# Altium schematic sheet Sheet1.SchDoc
size A4; SheetNumber: 1; SheetTotal: 1
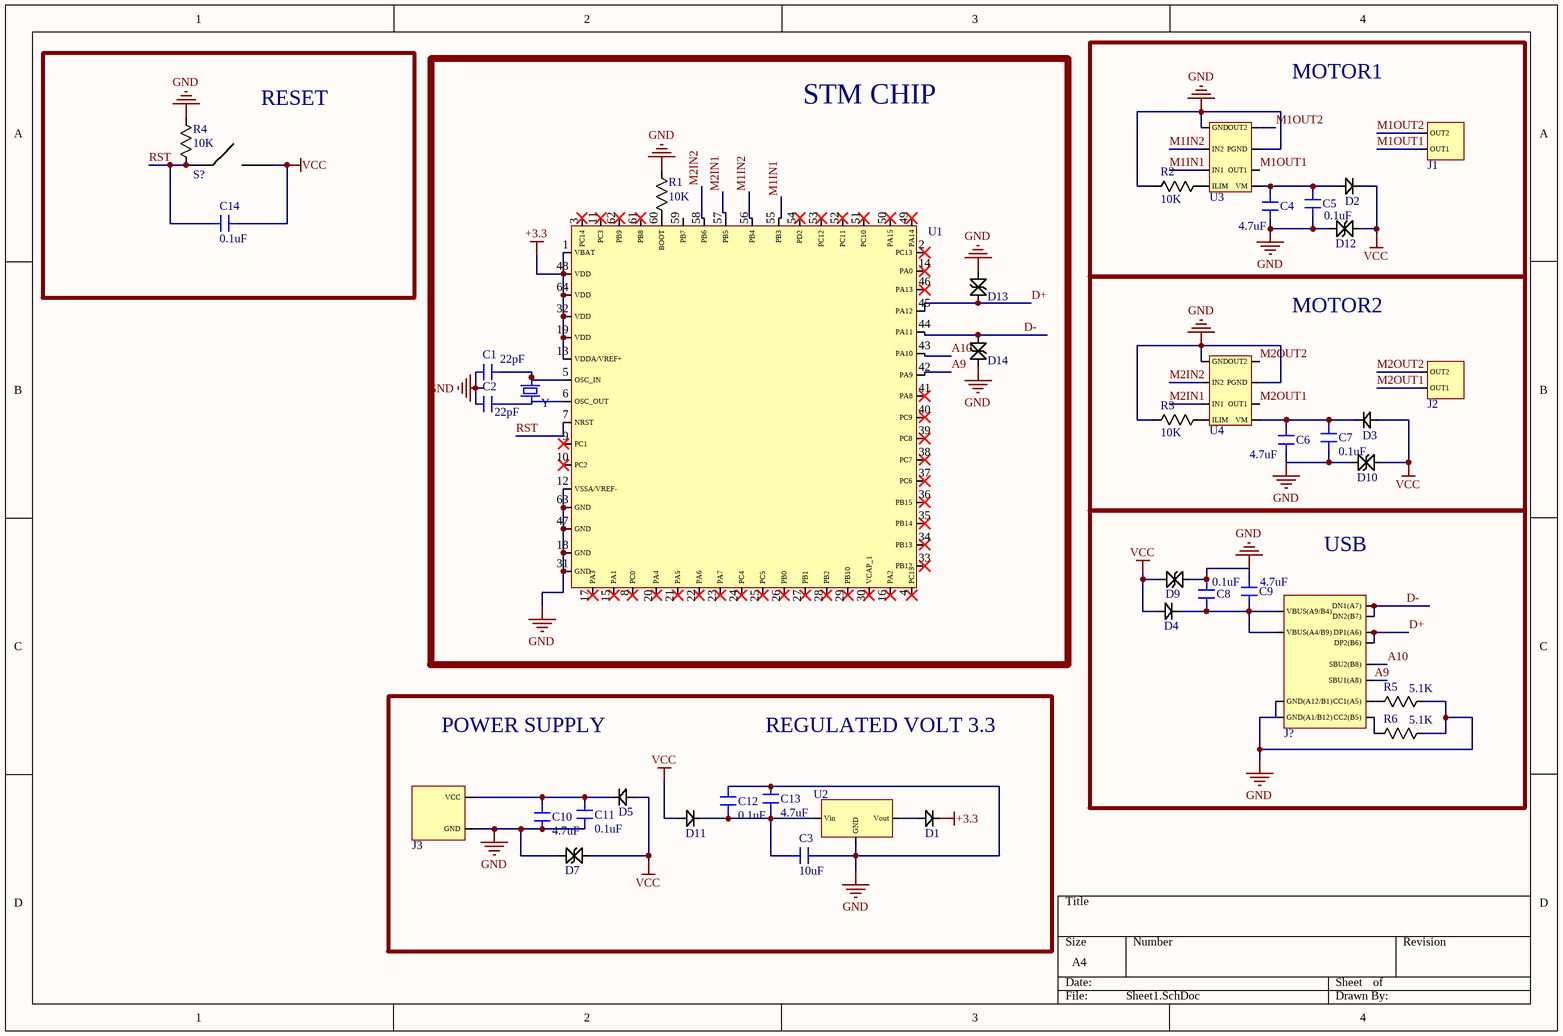
[diagram p0: Sheet1.SchDoc]

## Parts
C1  22pF  [CAPACITOR]
C2  22pF  [CAPACITOR]
C3  10uF  [CAPACITOR]
C4  4.7uF  [CAPACITOR]
C5  0.1uF  [CAPACITOR]
C6  4.7uF  [CAPACITOR]
C7  0.1uF  [CAPACITOR]
C8  0.1uF  [CAPACITOR]
C9  4.7uF  [CAPACITOR]
C10  4.7uF  [CAPACITOR]
C11  0.1uF  [CAPACITOR]
C12  0.1uF  [CAPACITOR]
C13  4.7uF  [CAPACITOR]
C14  0.1uF  [CAPACITOR]
D1  DIODE  [DIODE]  (value not drawn)
D2  DIODE  [DIODE]  (value not drawn)
D3  DIODE  [DIODE]  (value not drawn)
D4  DIODE  [DIODE]  (value not drawn)
D5  DIODE  [DIODE]  (value not drawn)
D7  TVS DIODE  [TVS DIODE]  (value not drawn)
D9  TVS DIODE  [TVS DIODE]  (value not drawn)
D10  TVS DIODE  [TVS DIODE]  (value not drawn)
D11  DIODE  [DIODE]  (value not drawn)
D12  TVS DIODE  [TVS DIODE]  (value not drawn)
D13  TVS DIODE  [TVS DIODE]  (value not drawn)
D14  TVS DIODE  [TVS DIODE]  (value not drawn)
J1  terminal block  [TERMINAL BLOCK]  (value not drawn)
J2  terminal block  [TERMINAL BLOCK]  (value not drawn)
J3  PLUGABLE BLOCK  [PLUGABLE]  (value not drawn)
J?  USB  [DIP32]  (value not drawn)
R1  10K  [Resistor]
R2  10K  [Resistor]
R3  10K  [Resistor]
R4  10K  [Resistor]
R5  5.1K  [Resistor]
R6  5.1K  [Resistor]
S?  BUTTON  [BUTTON]  (value not drawn)
U1  STM_CHIP  [TSQFP50P1270X1270X160-64N]  (value not drawn)
U2  REGULATOR  [REGULATOR]  (value not drawn)
U3  DRV8871  [SOIC127P600X170-8N]  (value not drawn)
U4  DRV8871  [SOIC127P600X170-8N]  (value not drawn)
Y  CRYSTAL  [CRYSTAL]  (value not drawn)

## Blocks framed on the sheet
RESET: C14 R4 S?
STM CHIP: C1 C2 D13 D14 R1 U1 Y
MOTOR1: C4 C5 D2 D12 J1 R2 U3
MOTOR2: C6 C7 D3 D10 J2 R3 U4
USB: C8 C9 D4 D9 J? R5 R6

## Nets
+3.3: D1.2 U1.1(VBAT) U1.13(VDDA/VREF+) U1.19(VDD) U1.32(VDD) U1.48(VDD) U1.64(VDD)
GND: C1.2 C2.2 C3.2 C4.1 C5.1 C6.1 C7.1 C8.1 C9.1 C10.1 C11.1 C12.1 C13.1 D7.1 D9.2 D10.1 D12.1 D13.2 D14.1 J3.2(GND) J?.1(GND(A1/B12)) J?.12(GND(A12/B1)) R1.2 R2.2 R3.2 R4.2 R5.1 R6.1 U1.12(VSSA/VREF-) U1.18(GND) U1.31(GND) U1.47(GND) U1.63(GND) U2.3(GND) U3.1(GND) U3.7(PGND) U4.1(GND) U4.7(PGND)
VCC: C14.1 D2.2 D3.1 D4.1 D5.1 D7.2 D9.1 D10.2 D11.1 D12.2 S?.2
A9: J?.9(SBU1(A8)) U1.42(PA9)
A10: J?.3(SBU2(B8)) U1.43(PA10)
D+: D13.1 J?.6(DP1(A6)) J?.8(DP2(B6)) U1.45(PA12)
D-: D14.2 J?.5(DN2(B7)) J?.7(DN1(A7)) U1.44(PA11)
M1IN1: U1.55(PB3) U3.3(IN1)
M1IN2: U1.56(PB4) U3.2(IN2)
M1OUT1: J1.1(OUT1) U3.6(OUT1)
M1OUT2: J1.2(OUT2) U3.8(OUT2)
M2IN1: U1.57(PB5) U4.3(IN1)
M2IN2: U1.58(PB6) U4.2(IN2)
M2OUT1: J2.1(OUT1) U4.6(OUT1)
M2OUT2: J2.2(OUT2) U4.8(OUT2)
RST: C14.2 R4.1 S?.1 U1.7(NRST)
NetC1_1: C1.1 U1.5(OSC_IN) Y.2
NetC2_1: C2.1 U1.6(OSC_OUT) Y.1
NetC3_1: C3.1 C12.2 C13.2 D11.2 U2.1(Vin)
NetC4_2: C4.2 C5.2 D2.1 U3.5(VM)
NetC6_2: C6.2 C7.2 D3.2 U4.5(VM)
NetC8_2: C8.2 C9.2 D4.2 J?.2(VBUS(A4/B9)) J?.11(VBUS(A9/B4))
NetC10_2: C10.2 C11.2 D5.2 J3.1(VCC)
NetD1_1: D1.1 U2.2(Vout)
NetJ?_4: J?.4(CC1(A5)) R5.2
NetJ?_10: J?.10(CC2(B5)) R6.2
NetR1_1: R1.1 U1.60(BOOT)
NetR2_1: R2.1 U3.4(ILIM)
NetR3_1: R3.1 U4.4(ILIM)

Not connected (* = marked no-connect by the designer): U1 2(PC13)* 3(PC14)* 4(PC15)* 8(PC0)* 9(PC1)* 10(PC2)* 11(PC3)* 14(PA0)* 15(PA1)* 16(PA2)* 17(PA3)* 20(PA4)* 21(PA5)* 22(PA6)* 23(PA7)* 24(PC4)* 25(PC5)* 26(PB0)* 27(PB1)* 28(PB2)* 29(PB10)* 30(VCAP_1)* 33(PB12)* 34(PB13)* 35(PB14)* 36(PB15)* 37(PC6)* 38(PC7)* 39(PC8)* 40(PC9)* 41(PA8)* 46(PA13)* 49(PA14)* 50(PA15)* 51(PC10)* 52(PC11)* 53(PC12)* 54(PD2)* 59(PB7) 61(PB8)* 62(PB9)*

## Notes on the sheet
- POWER SUPPLY
- REGULATED VOLT 3.3

## Library data of the parts
C1-C14 = CAPACITOR: 50V 22pF C0G ±5% 0402 Multilayer Ceramic Capacitors MLCC - SMD/SMT ROHS; Manufacturer: Murata Electronics; Mfr. Part: GRM1555C1H220JA01D; SUPPLIER: LCSC; LCSC Part: C76960
D1-D5 D11 = DIODE: 1A Independent Type 1.3V@1A 400V SMA(DO-214AC) Diodes - General Purpose ROHS; Manufacturer: SMC; Mfr. Part: RS1G; SUPPLIER: LCSC; LCSC Part: C260336
D7 D9 D10 D12-D14 = TVS DIODE: 45V 0603 ESD and Surge Protection (TVS/ESD) ROHS; Manufacturer: Littelfuse; Mfr. Part: PESD0603-240; SUPPLIER: LCSC; LCSC Part: C2929617
J1 J2 = terminal block: Plugin Screw Terminal Blocks ROHS; Manufacturer: TE Connectivity 282834-2; Mfr. Part: 282834-2; SUPPLIER: LCSC; LCSC Part: C592983
J3 = PLUGABLE BLOCK: P=2.54mm Pluggable System Terminal Block ROHS; Manufacturer: Cixi Kefa Elec; Mfr. Part: KF2024-2.54-2P; SUPLLIER: LCSC; LCSC Part: C42371572
J? = USB: 5A 1 16P Mother Type-C SMD USB Connectors ROHS; Manufacturer: Korean Hroparts; Mfr. Part: TYPE-C-31-M-12; SUPPLIER: LCSC; LCSC Part: C165948
R1-R6 = RESISTOR: Ceramic resistor ±1% 1206 Chip Resistor - Surface Mount ROHS; Manufacturer: Milliohm; Mfr. Part: HoCS1206-470mR-1%-TCR200; SUPPLIER: LCSC; LCSC Part: C2912641
U1 = STM_CHIP: ARM-M4 84MHz LQFP-64(10x10) Microcontrollers (MCU/MPU/SOC) ROHS; Manufacturer: STMicroelectronics; Mfr. Part: STM32F401RCT6; LCSC Part: C74524; SUPPLIER: LCSC
U2 = REGULATOR: SIP,17.5x11.5mm Isolated Power Modules ROHS; Manufacturer: Recom Power; Mfr. Part: R-78B3.3-1.0L; LCSC Part: C7270711; SUPPLIER: LCSC
U3 U4 = DRV8871: 3.6A Brushed DC Motor 6.8V~45V PWM SOIC-8-EP Motor Driver ICs ROHS; Manufacturer: Texas Instruments; Mfr. Part: DRV8871DDARQ1; SUPPLIER: LCSC; LCSC Part: C701805
Y = CRYSTAL: 16MHz 20pF ±30ppm ±50ppm HC-49S-SMD Crystals ROHS; Manufacturer: ECS; Mfr. Part: ECS-160-20-5PVX; SUPPLIER: LCSC; LCSC Part: C6611805